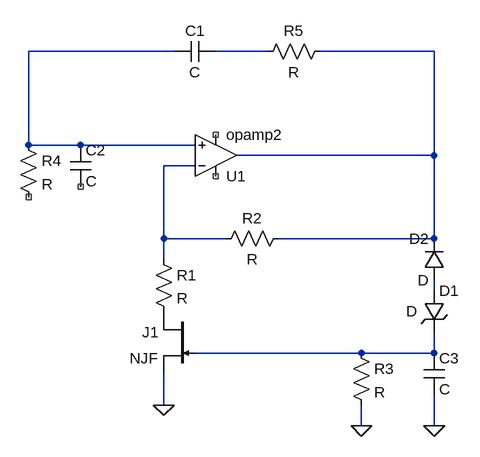
[diagram p0: schematic Draft1.asc]
Draft1.asc, the LTspice schematic file:
Version 4
SHEET 1 880 696
WIRE 64 80 -160 80
WIRE 208 80 128 80
WIRE 464 80 288 80
WIRE -160 224 -160 80
WIRE -80 224 -160 224
WIRE 96 224 -80 224
WIRE 464 240 464 80
WIRE 464 240 160 240
WIRE 96 256 48 256
WIRE 48 368 48 256
WIRE 144 368 48 368
WIRE 464 368 464 240
WIRE 464 368 224 368
WIRE 48 400 48 368
WIRE 464 448 464 432
WIRE 352 544 96 544
WIRE 464 544 464 512
WIRE 464 544 352 544
WIRE 48 624 48 576
WIRE 352 656 352 624
WIRE 464 656 464 608
FLAG 352 656 0
FLAG 464 656 0
FLAG 48 624 0
SYMBOL Opamps\\opamp2 128 304 M180
SYMATTR InstName U1
SYMBOL cap 128 64 R90
WINDOW 0 0 32 VBottom 2
WINDOW 3 32 32 VTop 2
SYMATTR InstName C1
SYMBOL cap -96 224 R0
SYMATTR InstName C2
SYMBOL cap 448 544 R0
SYMATTR InstName C3
SYMBOL res 32 384 R0
SYMATTR InstName R1
SYMBOL res 240 352 R90
WINDOW 0 0 56 VBottom 2
WINDOW 3 32 56 VTop 2
SYMATTR InstName R2
SYMBOL res 336 528 R0
SYMATTR InstName R3
SYMBOL res -176 208 R0
SYMATTR InstName R4
SYMBOL zener 448 448 R0
WINDOW 3 -27 32 Left 2
SYMATTR InstName D1
SYMBOL diode 480 432 R180
WINDOW 0 24 64 Left 2
WINDOW 3 24 0 Left 2
SYMATTR InstName D2
SYMBOL njf 96 480 M0
SYMATTR InstName J1
SYMBOL res 304 64 R90
WINDOW 0 0 56 VBottom 2
WINDOW 3 32 56 VTop 2
SYMATTR InstName R5

The netlist it stands for:
* Draft1.asc
XU1 N001 N004 NC_01 NC_02 N003 opamp2  ; pins In+ In- V+ V- OUT
C1 N002 N001 C
C2 N001 NC_03 C
C3 N006 0 C
R1 N004 P001 R
R2 N003 N004 R
R3 N006 0 R
R4 N001 NC_04 R
D1 N005 N006 D
D2 N005 N003 D
J1 P001 N006 0 NJF
R5 N003 N002 R
.model D D
.lib standard.dio
.model NJF NJF
.model PJF PJF
.lib standard.jft
.backanno
.end